# EAGLE schematic RS232_Prog+Conn_Adapter (EAGLE 7.6.0)
RS232 Adapter for Programmer and Communication
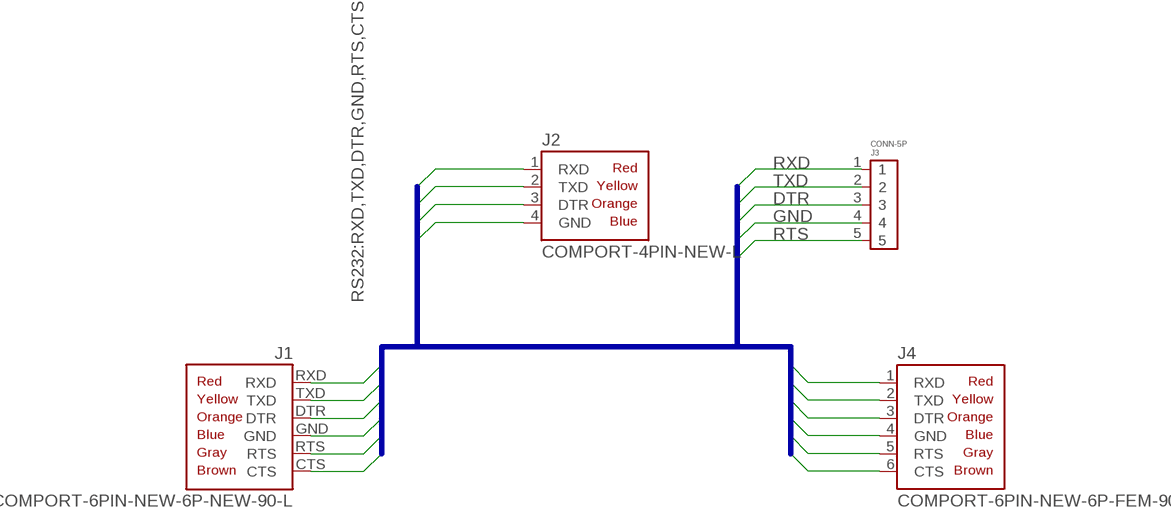
[diagram p0: schematic, sheet 1]

## Parts
J1  COMPORT-6PIN-NEW-6P-NEW-90-L  [RS232-6PIN-NEW-90-L]
J2  COMPORT-4PIN-NEW-L  [RS232-4PIN-NEW-L]
J3  CONN-5P  [CONN-5P-N]
J4  COMPORT-6PIN-NEW-6P-FEM-90  [CONN-6P-FEM-90]

## Nets
CTS: J1.CTS J4.6(CTS)
DTR: J1.DTR J2.3(DTR) J3.3 J4.3(DTR)
GND: J1.GND J2.4(GND) J3.4 J4.4(GND)
RTS: J1.RTS J3.5 J4.5(RTS)
RXD: J1.RXD J2.1(RXD) J3.1 J4.1(RXD)
TXD: J1.TXD J2.2(TXD) J3.2 J4.2(TXD)

## Buses
RS232:RXD,TXD,DTR,GND,RTS,CTS

## Library data of the parts
J1 J4 = pinconn:COMPORT-6PIN-NEW
J2 = pinconn:COMPORT-4PIN-NEW
J3 = pinconn:CONN-5P

## Net classes
0 default: width 0.61 mm